# Altium schematic sheet Sheet_UL.SchDoc
size A2
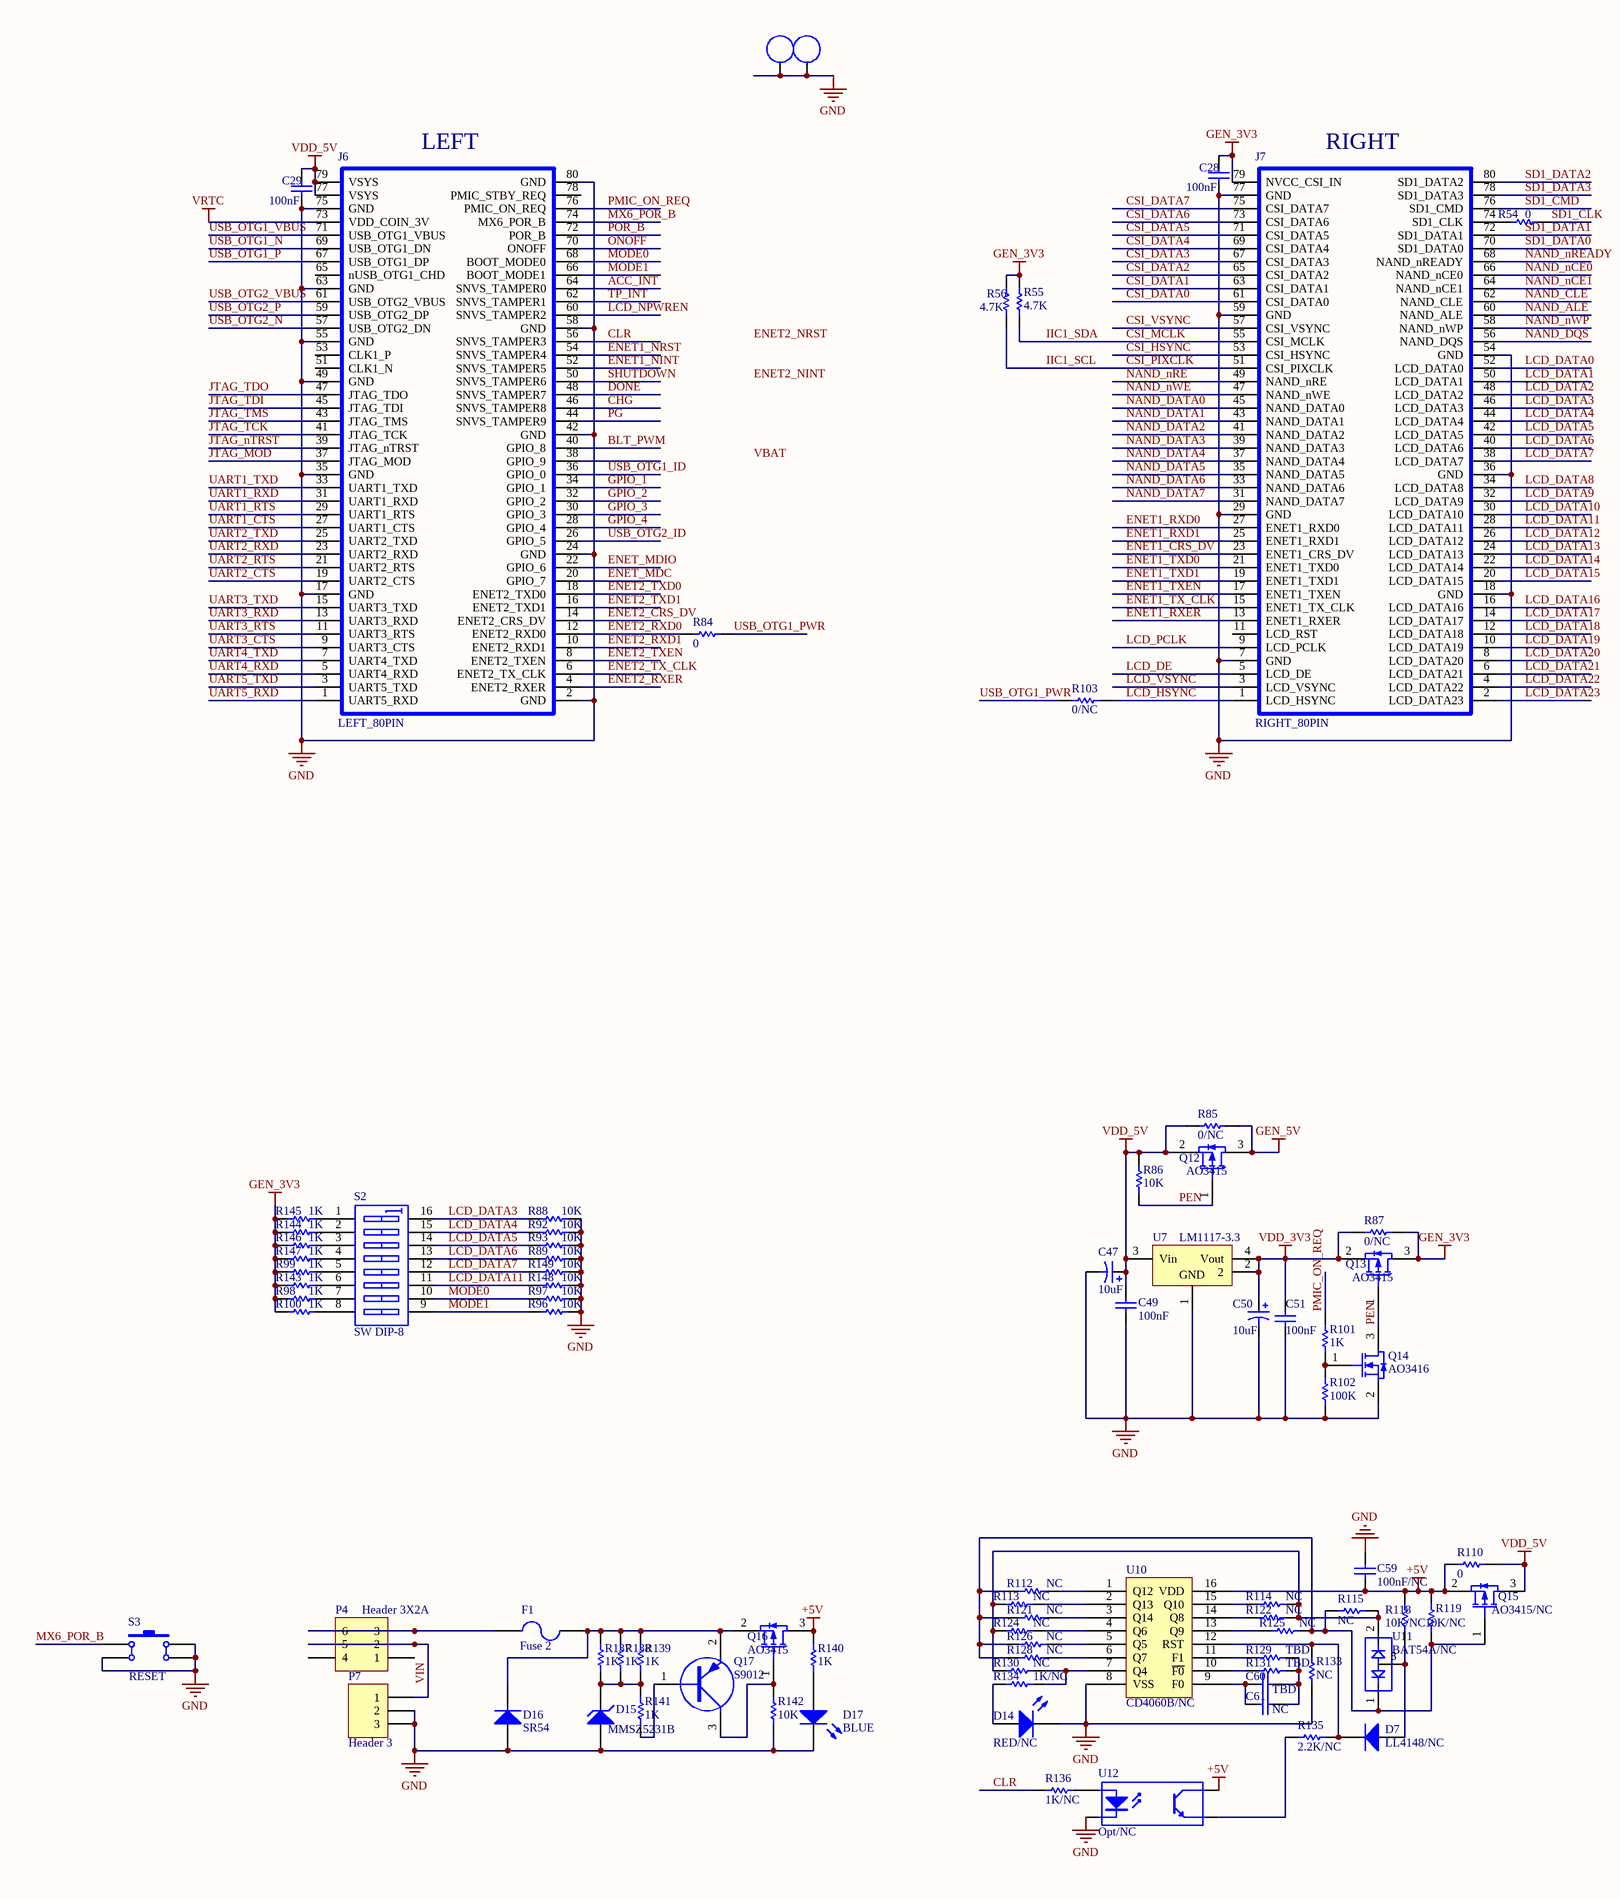
[diagram p0: Sheet_UL.SchDoc, left]
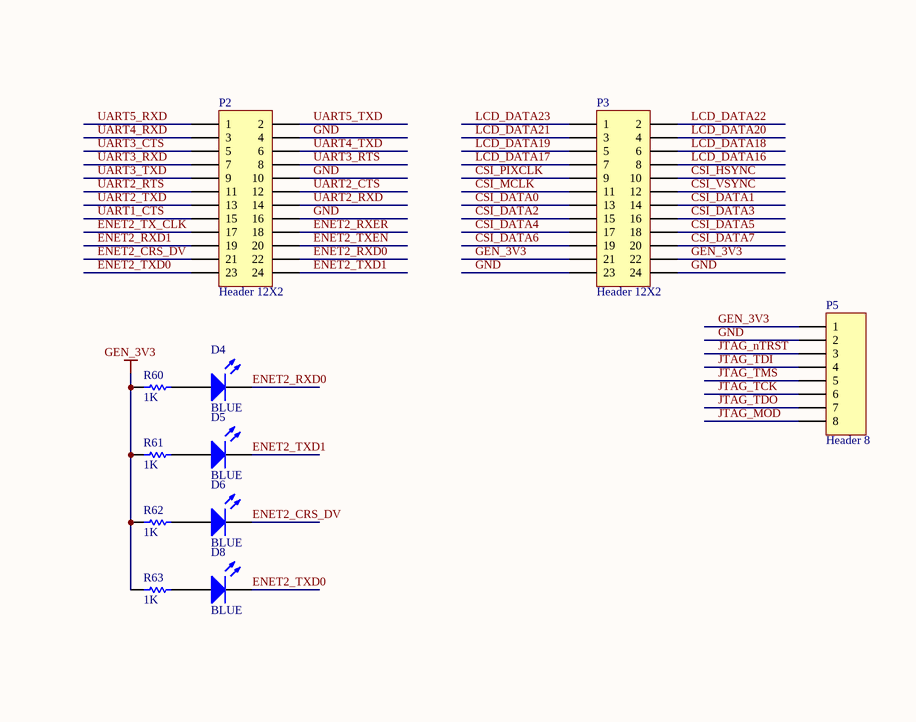
[diagram p1: Sheet_UL.SchDoc, right]

## Parts
C28  value 100nF  [0603]  (hidden comment: Cap)
C29  value 100nF  [0603]  (hidden comment: Cap)
C47  value 10uF  [3216A]  (hidden comment: Cap Pol1)
C49  value 100nF  [0603]  (hidden comment: Cap)
C50  value 10uF  [3216A]  (hidden comment: Cap Pol1)
C51  value 100nF  [0603]  (hidden comment: Cap)
C59  value 100nF/NC  [0603]  (hidden comment: Cap)
C60  value TBD  [0603]  (hidden comment: Cap)
C61  value NC  [0603]  (hidden comment: Cap)
D4  BLUE  [0603_]
D5  BLUE  [0603_]
D6  BLUE  [0603_]
D7  LL4148/NC  [1206_]
D8  BLUE  [0603_]
D14  RED/NC  [0603_]
D15  MMSZ5231B  [SOD-123]
D16  SR54  [SMB/DO-214AA]
D17  BLUE  [0603_]
F1  Fuse 2  [1812]
H10  hole  [HOLE_2]  (value not drawn)
H11  hole  [HOLE_2]  (value not drawn)
J6  LEFT_80PIN  [CON_80]
J7  RIGHT_80PIN  [CON_80]
P2  Header 12X2  [HDR2X12]
P3  Header 12X2  [HDR2X12]
P4  Header 3X2A  [ZSKG_8.5_8.5]
P5  Header 8  [HDR1X8]
P7  Header 3  [JACK-2.5MM_B]
Q12  AO3415  [SOT23]
Q13  AO3415  [SOT23]
Q14  AO3416  [SOT23]
Q15  AO3415/NC  [SOT23]
Q16  AO3415  [SOT23]
Q17  S9012  [SOT23]
R54  value 0  [0603]  (hidden comment: Res1)
R55  value 4.7K  [0603]  (hidden comment: Res1)
R56  value 4.7K  [0603]  (hidden comment: Res1)
R60  value 1K  [0603]  (hidden comment: Res1)
R61  value 1K  [0603]  (hidden comment: Res1)
R62  value 1K  [0603]  (hidden comment: Res1)
R63  value 1K  [0603]  (hidden comment: Res1)
R84  value 0  [0603]  (hidden comment: Res1)
R85  value 0/NC  [0805]  (hidden comment: Res1)
R86  value 10K  [0603]  (hidden comment: Res1)
R87  value 0/NC  [0603]  (hidden comment: Res1)
R88  value 10K  [0603]  (hidden comment: Res1)
R89  value 10K  [0603]  (hidden comment: Res1)
R92  value 10K  [0603]  (hidden comment: Res1)
R93  value 10K  [0603]  (hidden comment: Res1)
R96  value 10K  [0603]  (hidden comment: Res1)
R97  value 10K  [0603]  (hidden comment: Res1)
R98  value 1K  [0603]  (hidden comment: Res1)
R99  value 1K  [0603]  (hidden comment: Res1)
R100  value 1K  [0603]  (hidden comment: Res1)
R101  value 1K  [0603]  (hidden comment: Res1)
R102  value 100K  [0603]  (hidden comment: Res1)
R103  value 0/NC  [0603]  (hidden comment: Res1)
R110  value 0  [0805]  (hidden comment: Res1)
R112  value NC  [0603]  (hidden comment: Res1)
R113  value NC  [0603]  (hidden comment: Res1)
R114  value NC  [0603]  (hidden comment: Res1)
R115  value NC  [0603]  (hidden comment: Res1)
R118  value 10K/NC  [0603]  (hidden comment: Res1)
R119  value 10K/NC  [0603]  (hidden comment: Res1)
R121  value NC  [0603]  (hidden comment: Res1)
R122  value NC  [0603]  (hidden comment: Res1)
R124  value NC  [0603]  (hidden comment: Res1)
R125  value NC  [0603]  (hidden comment: Res1)
R126  value NC  [0603]  (hidden comment: Res1)
R128  value NC  [0603]  (hidden comment: Res1)
R129  value TBD  [0603]  (hidden comment: Res1)
R130  value NC  [0603]  (hidden comment: Res1)
R131  value TBD  [0603]  (hidden comment: Res1)
R133  value NC  [0603]  (hidden comment: Res1)
R134  value 1K/NC  [0603]  (hidden comment: Res1)
R135  value 2.2K/NC  [0603]  (hidden comment: Res1)
R136  value 1K/NC  [0603]  (hidden comment: Res1)
R137  value 1K  [0603]  (hidden comment: Res1)
R138  value 1K  [0603]  (hidden comment: Res1)
R139  value 1K  [0603]  (hidden comment: Res1)
R140  value 1K  [0603]  (hidden comment: Res1)
R141  value 1K  [0603]  (hidden comment: Res1)
R142  value 10K  [0603]  (hidden comment: Res1)
R143  value 1K  [0603]  (hidden comment: Res1)
R144  value 1K  [0603]  (hidden comment: Res1)
R145  value 1K  [0603]  (hidden comment: Res1)
R146  value 1K  [0603]  (hidden comment: Res1)
R147  value 1K  [0603]  (hidden comment: Res1)
R148  value 10K  [0603]  (hidden comment: Res1)
R149  value 10K  [0603]  (hidden comment: Res1)
S2  SW DIP-8  [SMD_8]
S3  RESET  [SW_6-6]
U7  LM1117-3.3  [SOT-223]
U10  CD4060B/NC  [SO-16]
U11  BAT54A/NC  [SOT23]
U12  Opt/NC  [SO-4]

## Nets
+5V: C59.2 Q15.2(S) Q16.3(D) R110.2 R118.2 R119.2 R140.2 U10.16(VDD) U12.4(C)
GEN_3V3: C28.2 J7.79(NVCC_CSI_IN) P3.21 P3.22 P5.1 Q13.3(D) R55.2 R56.2 R60.2 R61.2 R62.2 R63.2 R87.2 R98.1 R99.1 R100.1 R143.1 R144.1 R145.1 R146.1 R147.1
GEN_5V: Q12.3(D) R85.1
GND: C28.1 C29.2 C47.2 C49.1 C50.2 C51.2 C59.1 D14.2(K) D15.1(A) D16.1(A) D17.2(K) H10.1 H11.1 J6.2(GND) J6.17(GND) J6.24(GND) J6.35(GND) J6.42(GND) J6.49(GND) J6.55(GND) J6.58(GND) J6.63(GND) J6.75(GND) J6.80(GND) J7.7(GND) J7.18(GND) J7.29(GND) J7.36(GND) J7.54(GND) J7.59(GND) J7.77(GND) P2.4 P2.10 P2.16 P3.23 P3.24 P5.2 P7.2 P7.3 Q14.2(S) R88.2 R89.2 R92.2 R93.2 R96.1 R97.1 R102.1 R133.2 R142.2 R148.2 R149.2 S3.2 S3.3 S3.4 U7.1(GND) U10.8(VSS) U12.2(K)
VDD_3V3: C50.1 C51.1 Q13.2(S) R87.1 U7.2 U7.4(Vout)
VDD_5V: C29.1 C47.1 C49.2 J6.77(VSYS) J6.79(VSYS) Q12.2(S) Q15.3(D) R85.2 R86.2 R110.1 U7.3(Vin)
VRTC: J6.73(VDD_COIN_3V)
ACC_INT: J6.64(SNVS_TAMPER0)
BLT_PWM: J6.40(GPIO_8)
CHG: J6.46(SNVS_TAMPER8)
CLR: J6.56(SNVS_TAMPER3) R136.1
CSI_DATA0: J7.61(CSI_DATA0) P3.13
CSI_DATA1: J7.63(CSI_DATA1) P3.14
CSI_DATA2: J7.65(CSI_DATA2) P3.15
CSI_DATA3: J7.67(CSI_DATA3) P3.16
CSI_DATA4: J7.69(CSI_DATA4) P3.17
CSI_DATA5: J7.71(CSI_DATA5) P3.18
CSI_DATA6: J7.73(CSI_DATA6) P3.19
CSI_DATA7: J7.75(CSI_DATA7) P3.20
CSI_HSYNC: J7.53(CSI_HSYNC) P3.10
CSI_MCLK: J7.55(CSI_MCLK) P3.11 R55.1  [also labelled IIC1_SDA]
CSI_PIXCLK: J7.51(CSI_PIXCLK) P3.9 R56.1  [also labelled IIC1_SCL]
CSI_VSYNC: J7.57(CSI_VSYNC) P3.12
DONE: J6.48(SNVS_TAMPER7)
ENET1_CRS_DV: J7.23(ENET1_CRS_DV)
ENET1_NINT: J6.52(SNVS_TAMPER5)
ENET1_NRST: J6.54(SNVS_TAMPER4)
ENET1_RXD0: J7.27(ENET1_RXD0)
ENET1_RXD1: J7.25(ENET1_RXD1)
ENET1_RXER: J7.13(ENET1_RXER)
ENET1_TX_CLK: J7.15(ENET1_TX_CLK)
ENET1_TXD0: J7.21(ENET1_TXD0)
ENET1_TXD1: J7.19(ENET1_TXD1)
ENET1_TXEN: J7.17(ENET1_TXEN)
ENET2_CRS_DV: D6.2(K) J6.14(ENET2_CRS_DV) P2.21
ENET2_RXD0: D4.2(K) J6.12(ENET2_RXD0) P2.22 R84.1
ENET2_RXD1: J6.10(ENET2_RXD1) P2.19
ENET2_RXER: J6.4(ENET2_RXER) P2.18
ENET2_TX_CLK: J6.6(ENET2_TX_CLK) P2.17
ENET2_TXD0: D8.2(K) J6.18(ENET2_TXD0) P2.23
ENET2_TXD1: D5.2(K) J6.16(ENET2_TXD1) P2.24
ENET2_TXEN: J6.8(ENET2_TXEN) P2.20
ENET_MDC: J6.20(GPIO_7)
ENET_MDIO: J6.22(GPIO_6)
GPIO_1: J6.34(GPIO_1)
GPIO_2: J6.32(GPIO_2)
GPIO_3: J6.30(GPIO_3)
GPIO_4: J6.28(GPIO_4)
JTAG_MOD: J6.37(JTAG_MOD) P5.8
JTAG_nTRST: J6.39(JTAG_nTRST) P5.3
JTAG_TCK: J6.41(JTAG_TCK) P5.6
JTAG_TDI: J6.45(JTAG_TDI) P5.4
JTAG_TDO: J6.47(JTAG_TDO) P5.7
JTAG_TMS: J6.43(JTAG_TMS) P5.5
LCD_DATA0: J7.52(LCD_DATA0)
LCD_DATA1: J7.50(LCD_DATA1)
LCD_DATA2: J7.48(LCD_DATA2)
LCD_DATA3: J7.46(LCD_DATA3) R88.1 S2.16(B1)
LCD_DATA4: J7.44(LCD_DATA4) R92.1 S2.15(B2)
LCD_DATA5: J7.42(LCD_DATA5) R93.1 S2.14(B3)
LCD_DATA6: J7.40(LCD_DATA6) R89.1 S2.13(B4)
LCD_DATA7: J7.38(LCD_DATA7) R149.1 S2.12(B5)
LCD_DATA8: J7.34(LCD_DATA8)
LCD_DATA9: J7.32(LCD_DATA9)
LCD_DATA10: J7.30(LCD_DATA10)
LCD_DATA11: J7.28(LCD_DATA11) R148.1 S2.11(B6)
LCD_DATA12: J7.26(LCD_DATA12)
LCD_DATA13: J7.24(LCD_DATA13)
LCD_DATA14: J7.22(LCD_DATA14)
LCD_DATA15: J7.20(LCD_DATA15)
LCD_DATA16: J7.16(LCD_DATA16) P3.8
LCD_DATA17: J7.14(LCD_DATA17) P3.7
LCD_DATA18: J7.12(LCD_DATA18) P3.6
LCD_DATA19: J7.10(LCD_DATA19) P3.5
LCD_DATA20: J7.8(LCD_DATA20) P3.4
LCD_DATA21: J7.6(LCD_DATA21) P3.3
LCD_DATA22: J7.4(LCD_DATA22) P3.2
LCD_DATA23: J7.2(LCD_DATA23) P3.1
LCD_DE: J7.5(LCD_DE)
LCD_HSYNC: J7.1(LCD_HSYNC) R103.2
LCD_NPWREN: J6.60(SNVS_TAMPER2)
LCD_PCLK: J7.9(LCD_PCLK)
LCD_VSYNC: J7.3(LCD_VSYNC)
MODE0: J6.68(BOOT_MODE0) R97.2 S2.10(B7)
MODE1: J6.66(BOOT_MODE1) R96.2 S2.9(B8)
MX6_POR_B: J6.74(MX6_POR_B) S3.1
NAND_ALE: J7.60(NAND_ALE)
NAND_CLE: J7.62(NAND_CLE)
NAND_DATA0: J7.45(NAND_DATA0)
NAND_DATA1: J7.43(NAND_DATA1)
NAND_DATA2: J7.41(NAND_DATA2)
NAND_DATA3: J7.39(NAND_DATA3)
NAND_DATA4: J7.37(NAND_DATA4)
NAND_DATA5: J7.35(NAND_DATA5)
NAND_DATA6: J7.33(NAND_DATA6)
NAND_DATA7: J7.31(NAND_DATA7)
NAND_DQS: J7.56(NAND_DQS)
NAND_nCE0: J7.66(NAND_nCE0)
NAND_nCE1: J7.64(NAND_nCE1)
NAND_nRE: J7.49(NAND_nRE)
NAND_nREADY: J7.68(NAND_nREADY)
NAND_nWE: J7.47(NAND_nWE)
NAND_nWP: J7.58(NAND_nWP)
ONOFF: J6.70(ONOFF)
PEN: Q12.1(G) Q13.1(G) Q14.3(D) R86.1
PG: J6.44(SNVS_TAMPER9)
PMIC_ON_REQ: J6.76(PMIC_ON_REQ) R101.2
POR_B: J6.72(POR_B)
SD1_CLK: R54.2
SD1_CMD: J7.76(SD1_CMD)
SD1_DATA0: J7.70(SD1_DATA0)
SD1_DATA1: J7.72(SD1_DATA1)
SD1_DATA2: J7.80(SD1_DATA2)
SD1_DATA3: J7.78(SD1_DATA3)
SHUTDOWN: J6.50(SNVS_TAMPER6)
TP_INT: J6.62(SNVS_TAMPER1)
UART1_CTS: J6.27(UART1_CTS) P2.15
UART1_RTS: J6.29(UART1_RTS)
UART1_RXD: J6.31(UART1_RXD)
UART1_TXD: J6.33(UART1_TXD)
UART2_CTS: J6.19(UART2_CTS) P2.12
UART2_RTS: J6.21(UART2_RTS) P2.11
UART2_RXD: J6.23(UART2_RXD) P2.14
UART2_TXD: J6.25(UART2_TXD) P2.13
UART3_CTS: J6.9(UART3_CTS) P2.5
UART3_RTS: J6.11(UART3_RTS) P2.8
UART3_RXD: J6.13(UART3_RXD) P2.7
UART3_TXD: J6.15(UART3_TXD) P2.9
UART4_RXD: J6.5(UART4_RXD) P2.3
UART4_TXD: J6.7(UART4_TXD) P2.6
UART5_RXD: J6.1(UART5_RXD) P2.1
UART5_TXD: J6.3(UART5_TXD) P2.2
USB_OTG1_ID: J6.36(GPIO_0)
USB_OTG1_N: J6.69(USB_OTG1_DN)
USB_OTG1_P: J6.67(USB_OTG1_DP)
USB_OTG1_PWR: R84.2 R103.1
USB_OTG1_VBUS: J6.71(USB_OTG1_VBUS)
USB_OTG2_ID: J6.26(GPIO_5)
USB_OTG2_N: J6.57(USB_OTG2_DN)
USB_OTG2_P: J6.59(USB_OTG2_DP)
USB_OTG2_VBUS: J6.61(USB_OTG2_VBUS)
VIN: P4.2 P4.5 P7.1
NetC60_1: C60.1 C61.1 U10.9(F0)
NetC60_2: C60.2 C61.2 R129.2 R131.2
NetD4_1: D4.1(A) R60.1
NetD5_1: D5.1(A) R61.1
NetD6_1: D6.1(A) R62.1
NetD7_1: D7.1(A) R118.1 U11.3
NetD7_2: D7.2(K) R133.1 R135.2 U10.12(RST)
NetD8_1: D8.1(A) R63.1
NetD14_1: D14.1(A) R134.1
NetD15_2: D15.2(K) R137.2 R138.2 R139.2 R141.2
NetD16_2: D16.2(K) F1.2 Q16.2(S) Q17.2(E) R137.1 R138.1 R139.1
NetD17_1: D17.1(A) R140.1
NetF1_1: F1.1 P4.3 P4.6
NetJ7_74: J7.74(SD1_CLK) R54.1
NetQ14_1: Q14.1(G) R101.1 R102.2
NetQ15_1: Q15.1(G) R112.1 R115.2 R119.1 R121.1 R125.2 R126.1 R128.1 U11.1
NetQ16_1: Q16.1(G) Q17.3(C) R142.1
NetQ17_1: Q17.1(B) R141.1
NetR98_2: R98.2 S2.7(A7)
NetR99_2: R99.2 S2.5(A5)
NetR100_2: R100.2 S2.8(A8)
NetR112_2: R112.2 U10.1(Q12)
NetR113_1: R113.1 R114.2 R115.1 R122.2 R124.1 R130.1 U11.2
NetR113_2: R113.2 U10.2(Q13)
NetR114_1: R114.1 U10.15(Q10)
NetR121_2: R121.2 U10.3(Q14)
NetR122_1: R122.1 U10.14(Q8)
NetR124_2: R124.2 U10.4(Q6)
NetR125_1: R125.1 U10.13(Q9)
NetR126_2: R126.2 U10.5(Q5)
NetR128_2: R128.2 U10.6(Q7)
NetR129_1: R129.1 U10.11(F1)
NetR130_2: R130.2 R134.2 U10.7(Q4)
NetR131_1: R131.1 U10.10(~{F0})
NetR135_1: R135.1 U12.3(E)
NetR136_2: R136.2 U12.1(A)
NetR143_2: R143.2 S2.6(A6)
NetR144_2: R144.2 S2.2(A2)
NetR145_2: R145.2 S2.1(A1)
NetR146_2: R146.2 S2.3(A3)
NetR147_2: R147.2 S2.4(A4)

Not connected (* = marked no-connect by the designer): J6 38(GPIO_9) 51(CLK1_N) 53(CLK1_P) 65(nUSB_OTG1_CHD) 78(PMIC_STBY_REQ); J7 11(LCD_RST); P4 1 4

## Notes on the sheet
- (near J6) LEFT
- (near J7) RIGHT
- Labels drawn without touching a wire or pin: ENET2_NINT, ENET2_NRST, VBAT

## Library data of the parts
C28 C29 C49 C51 C59-C61 = Cap: Capacitor; Published: 8-Jun-2000; LatestRevisionDate: 17-Jul-2002; LatestRevisionNote: Re-released for DXP Platform.; PackageReference: RAD-0.3; Publisher: Altium Limited; PackageDescription: Radial Cap, Thru-Hole; 2 Leads; 0.3 in Pin Spacing
C47 C50 = Cap Pol1: Polarized Capacitor (Radial); Published: 8-Jun-2000; LatestRevisionDate: 17-Jul-2002; LatestRevisionNote: Re-released for DXP Platform.; PackageReference: RB7.6-15; Publisher: Altium Limited; PackageDescription: Polarized Capacitor (Radial); 2 Leads
D4-D6 D8 D14 D17 = LED0: Typical INFRARED GaAs LED; Published: 8-Jun-2000; LatestRevisionDate: 08-Jul-2005; LatestRevisionNote: Mech Layer 1 removed.; PackageReference: LED-0; Publisher: Altium Limited; PackageDescription: LED; 2 Leads
D7 D16 = Diode: Default Diode; Published: 8-Jun-2000; LatestRevisionDate: 17-Jul-2002; LatestRevisionNote: Re-released for DXP Platform.; PackageVersion: Sep-1996; PackageReference: SMC; Publisher: Altium Limited; PackageDescription: DO-214-AB/SMC; 2 C-Bend Leads; Body 7.9 x 5.9 mm, inc. leads (LxW); Code_JEDEC: DO-214-AB
D15 = D Zener: Zener Diode; Published: 8-Jun-2000; LatestRevisionDate: 17-Jul-2002; LatestRevisionNote: Re-released for DXP Platform.; PackageReference: DIODE-0.7; Publisher: Altium Limited; PackageDescription: Diode, Thru-Hole; 2 Leads; 0.7 in Pin Spacing
F1 = Fuse 2: Fuse; Published: 8-Jun-2000; LatestRevisionDate: 17-Jul-2002; LatestRevisionNote: Re-released for DXP Platform.; PackageReference: PIN-W2/E2.8; Publisher: Altium Limited; PackageDescription: Thru-Hole; 2 Leads
P2 P3 = Header 12X2: Header, 12-Pin, Dual row; LatestRevisionDate: 17-Jul-2002; LatestRevisionNote: Re-released for DXP Platform.; Publisher: Altium Limited
P4 = Header 3X2A: Header, 3-Pin, Dual row; LatestRevisionDate: 17-Jul-2002; LatestRevisionNote: Re-released for DXP Platform.; Publisher: Altium Limited
P5 = Header 8: Header, 8-Pin; LatestRevisionDate: 17-Jul-2002; LatestRevisionNote: Re-released for DXP Platform.; Publisher: Altium Limited
P7 = Header 3: Header, 3-Pin; LatestRevisionDate: 17-Jul-2002; LatestRevisionNote: Re-released for DXP Platform.; Publisher: Altium Limited
Q12 Q13 Q15 Q16 = MOSFET-P_1: P-Channel MOSFET; Published: 8-Jun-2000; LatestRevisionDate: 17-Jul-2002; LatestRevisionNote: Re-released for DXP Platform.; PackageVersion: 1995/1996; PackageReference: E3; Publisher: Altium Limited; PackageDescription: TO, Flat Index; 3 In-Line, Axial Leads; Body Dia. 4.6mm; Lead Dia. 0.5 mm (max)
Q14 = MOSFET-P_1: N-Channel MOSFET; Published: 8-Jun-2000; LatestRevisionDate: 17-Jul-2002; LatestRevisionNote: Re-released for DXP Platform.; PackageVersion: 1995/1996; PackageReference: E3; Publisher: Altium Limited; PackageDescription: TO, Flat Index; 3 In-Line, Axial Leads; Body Dia. 4.6mm; Lead Dia. 0.5 mm (max)
Q17 = PNP: PNP Transistor
R54-R56 R60-R63 R84-R89 R92 R93 R96-R103 R110 R112-R115 R118 R119 R121 R122 R124-R126 R128-R131 R133-R149 = Res1: Resistor; Published: 8-Jun-2000; LatestRevisionDate: 17-Jul-2002; LatestRevisionNote: Re-released for DXP Platform.; PackageReference: AXIAL-0.3; Publisher: Altium Limited; PackageDescription: Axial Device, Thru-Hole; 2 Leads; 0.3 in Pin Spacing
S2 = SW DIP-8: DIP Switch, 8 Position, SPST; Published: 24-Mar-1999; LatestRevisionDate: 17-Jul-2002; LatestRevisionNote: Re-released for DXP Platform.; PackageReference: DIP_SW_8WAY_SMD; Publisher: Altium Limited; PackageDescription: DIP Switch; 16 Leads
S3 = SW-PB-4: Published: 24-Mar-1999; LatestRevisionDate: 17-Jul-2002; LatestRevisionNote: Re-released for DXP Platform.; PackageReference: SPST-2; Publisher: Altium Limited; PackageDescription: Switch; 2 Leads
U7 = Volt Reg: Voltage Regulator; Published: 24-Mar-1999; LatestRevisionDate: 29-May-2009; LatestRevisionNote: IPC-7351 Footprint Added.; PackageReference: D2PAK; Publisher: Altium Limited; PackageDescription: 3-Pin Transistor Outline Package 2.54 mm Pitch, 15.1 mm Lead Span
U10 = CD4060B
U11 = BAT54A
U12 = Optoisolator1: 4-Pin Phototransistor Optocoupler; Published: 24-Mar-1999; LatestRevisionDate: 04-Mar-2005; LatestRevisionNote: Sch pins 3 & 4 Swapped.; DatasheetVersion: Nov-2003; PackageReference: DIP-4; Publisher: Altium Limited